# Altium schematic sheet JTAG_Configuration.SchDoc: RFSoC AMC
size 420 x 297 mm; CompanyName: WUT; DrawnBy: T. Przywozki; Organization: WUT ISE; Address1: Warsaw University of Technology; Address2: Nowowiejska 15/19 00-665 Warsaw; Address3: Tomasz.Przywozki@pw.edu.pl; DocumentNumber: 38; Revision: 1; SheetNumber: 38; SheetTotal: 45; Project: RFSoC AMC; ModifiedBy: T. Przywozki; CreateDate: -; CheckedDate: -; DivGrp: ISE; Designer: T. Przywozki; ModifiedDate: -; ProjectName: ADC/DAC MEZZANINE
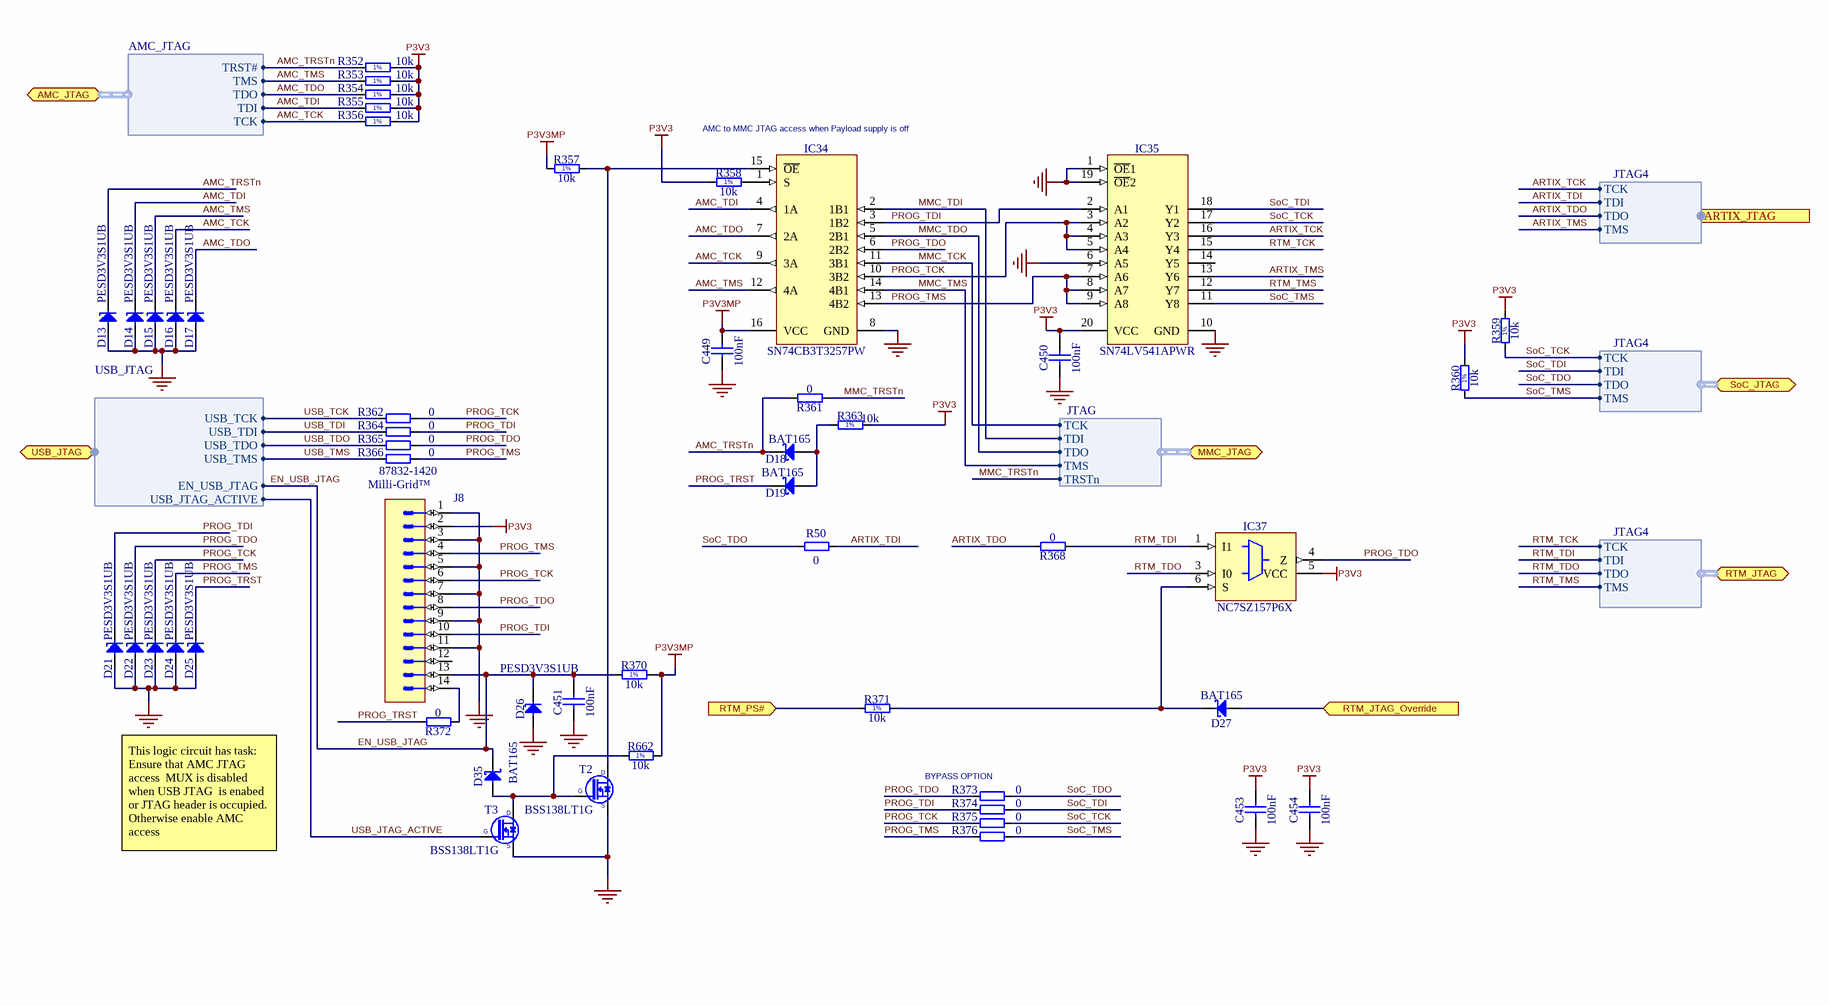
[diagram p0: JTAG_Configuration.SchDoc]

## Parts
C449  100nF  [CAPC0603X33N]
C450  100nF  [CAPC0603X33N]
C451  100nF  [CAPC0603X33N]
C453  100nF  [CAPC0603X33N]
C454  100nF  [CAPC0603X33N]
D13  PESD3V3S1UB  [SODFL1608X65N]
D14  PESD3V3S1UB  [SODFL1608X65N]
D15  PESD3V3S1UB  [SODFL1608X65N]
D16  PESD3V3S1UB  [SODFL1608X65N]
D17  PESD3V3S1UB  [SODFL1608X65N]
D18  BAT165  [SOD2512X110N]
D19  BAT165  [SOD2512X110N]
D21  PESD3V3S1UB  [SODFL1608X65N]
D22  PESD3V3S1UB  [SODFL1608X65N]
D23  PESD3V3S1UB  [SODFL1608X65N]
D24  PESD3V3S1UB  [SODFL1608X65N]
D25  PESD3V3S1UB  [SODFL1608X65N]
D26  PESD3V3S1UB  [SODFL1608X65N]
D27  BAT165  [SOD2512X110N]
D35  BAT165  [SOD2512X110N]
IC34  SN74CB3T3257PW  [SOP65P640X120-16N]
IC35  SN74LV541APWR  [SOP65P640X120-20N]
IC37  NC7SZ157P6X  [SOT65P210X110-6N]
J8  Milli-Grid™  Manufacturer Part Number: 87832-1420  [MOLEX_87832-1420]
R50  0  [RESC1005X40N]
R352  10k  [RESC1005X40N]
R353  10k  [RESC1005X40N]
R354  10k  [RESC1005X40N]
R355  10k  [RESC1005X40N]
R356  10k  [RESC1005X40N]
R357  10k  [RESC1005X40N]
R358  10k  [RESC1005X40N]
R359  10k  [RESC1005X40N]
R360  10k  [RESC1005X40N]
R361  0  [RESC1005X40N]
R362  0  [RESC1005X40N]
R363  10k  [RESC1005X40N]
R364  0  [RESC1005X40N]
R365  0  [RESC1005X40N]
R366  0  [RESC1005X40N]
R368  0  [RESC1005X40N]
R370  10k  [RESC1005X40N]
R371  10k  [RESC1005X40N]
R372  0  [RESC1005X40N]
R373  0  [RESC1005X40N]
R374  0  [RESC1005X40N]
R375  0  [RESC1005X40N]
R376  0  [RESC1005X40N]
R662  10k  [RESC1005X40N]
T2  BSS138LT1G  [SOT95P240X110-3N]
T3  BSS138LT1G  [SOT95P240X110-3N]

## Ports
AMC_JTAG (bidir, harness AMC_JTAG), ARTIX_JTAG (harness JTAG4), MMC_JTAG (bidir, harness JTAG), RTM_JTAG (bidir, harness JTAG4), RTM_JTAG_Override (in), RTM_PS# (in), SoC_JTAG (bidir, harness JTAG4), USB_JTAG (bidir, harness USB_JTAG)

## Harnesses
JTAG4: TCK, TDI, TDO, TMS
JTAG: TCK, TDI, TDO, TMS, TRSTn
USB_JTAG: USB_TDI, USB_TCK, USB_TMS, USB_TDO, USB_JTAG_ACTIVE, EN_USB_JTAG
AMC_JTAG: TCK, TDI, TDO, TMS, TRST#

## Nets
GND: C449.1 C450.1 C451.1 C453.1 C454.1 D13.2(A) D14.2(A) D15.2(A) D16.2(A) D17.2(A) D21.2(A) D22.2(A) D23.2(A) D24.2(A) D25.2(A) D26.2(A) IC34.8(GND) IC35.1(~{OE}1) IC35.6(A5) IC35.10(GND) IC35.19(~{OE}2) IC37.2(GND) J8.1 J8.3 J8.5 J8.7 J8.9 J8.11 T2.2(S) T3.2(S)
P3V3: C450.2 C453.2 C454.2 IC35.20(VCC) IC37.5(VCC) J8.2 R352.1 R353.1 R354.1 R355.1 R356.1 R358.2 R359.2 R360.2 R363.1
P3V3MP: C449.2 IC34.16(VCC) R357.2 R370.2 R662.2
AMC_TCK: D16.1(C) IC34.9(3A) R356.2 ; port AMC_JTAG.TCK
AMC_TDI: D14.1(C) IC34.4(1A) R355.2 ; port AMC_JTAG.TDI
AMC_TDO: D17.1(C) IC34.7(2A) R354.2 ; port AMC_JTAG.TDO
AMC_TMS: D15.1(C) IC34.12(4A) R353.2 ; port AMC_JTAG.TMS
AMC_TRSTn: D13.1(C) D18.1(C) R352.2 R361.2 ; port AMC_JTAG.TRST#
ARTIX_TCK: IC35.16(Y3) ; port ARTIX_JTAG.TCK
ARTIX_TDI: R50.1 ; port ARTIX_JTAG.TDI
ARTIX_TDO: R368.2 ; port ARTIX_JTAG.TDO
ARTIX_TMS: IC35.13(Y6) ; port ARTIX_JTAG.TMS
EN_USB_JTAG: C451.2 D26.1(C) D35.1(C) J8.13 R370.1 ; port USB_JTAG.EN_USB_JTAG
MMC_TCK: IC34.11(3B1) ; port MMC_JTAG.TCK
MMC_TDI: IC34.2(1B1) ; port MMC_JTAG.TDI
MMC_TDO: IC34.5(2B1) ; port MMC_JTAG.TDO
MMC_TMS: IC34.14(4B1) ; port MMC_JTAG.TMS
MMC_TRSTn: R361.1 ; port MMC_JTAG.TRSTn
PROG_TCK: D23.1(C) IC34.10(3B2) IC35.3(A2) IC35.4(A3) IC35.5(A4) J8.6 R362.1 R375.2
PROG_TDI: D21.1(C) IC34.3(1B2) IC35.2(A1) J8.10 R364.1 R374.2
PROG_TDO: D22.1(C) IC34.6(2B2) IC37.4(Z) J8.8 R365.1 R373.2
PROG_TMS: D24.1(C) IC34.13(4B2) IC35.7(A6) IC35.8(A7) IC35.9(A8) J8.4 R366.1 R376.2
PROG_TRST: D19.1(C) D25.1(C) R372.2
RTM_JTAG_Override: D27.2(A) ; port RTM_JTAG_Override
RTM_PS#: R371.2 ; port RTM_PS#
RTM_TCK: IC35.15(Y4) ; port RTM_JTAG.TCK
RTM_TDI: IC37.1(I1) R368.1 ; port RTM_JTAG.TDI
RTM_TDO: IC37.3(I0) ; port RTM_JTAG.TDO
RTM_TMS: IC35.12(Y7) ; port RTM_JTAG.TMS
SoC_TCK: IC35.17(Y2) R359.1 R375.1 ; port SoC_JTAG.TCK
SoC_TDI: IC35.18(Y1) R374.1 ; port SoC_JTAG.TDI
SoC_TDO: R50.2 R373.1 ; port SoC_JTAG.TDO
SoC_TMS: IC35.11(Y8) R360.1 R376.1 ; port SoC_JTAG.TMS
USB_JTAG_ACTIVE: T3.1(G) ; port USB_JTAG.USB_JTAG_ACTIVE
USB_TCK: R362.2 ; port USB_JTAG.USB_TCK
USB_TDI: R364.2 ; port USB_JTAG.USB_TDI
USB_TDO: R365.2 ; port USB_JTAG.USB_TDO
USB_TMS: R366.2 ; port USB_JTAG.USB_TMS
NetD18_2: D18.2(A) D19.2(A) R363.2
NetD27_1: D27.1(C) IC37.6(S) R371.1
NetD35_2: D35.2(A) R662.1 T2.1(G) T3.3(D)
NetIC34_1: IC34.1(S) R358.1
NetIC34_15: IC34.15(~{OE}) R357.1 T2.3(D)
NetJ8_14: J8.14 R372.1

Not connected (* = marked no-connect by the designer): IC35 14(Y5); J8 12

## Notes on the sheet
- AMC to MMC JTAG access when Payload supply is off
- (near R373) BYPASS OPTION
- This logic circuit has task: Ensure that AMC JTAG access  MUX is disabled when USB JTAG  is enabed or JTAG header is occupied. Otherwise enable AMC access
- Project/Equipment
- Document
- Designer
- Drawn by
- Check.by
- Copyright WUT ISE 2021
  This documentation describes Open Hardware and is licensed under CERN OHL v.1.1. You may redistribute and modify this documentaction under the terms of the CERN OHL v1.1.
  (http://ohwr.org/CERNOHL). This documentation is dristributed WITHOUT ANY EXPRESS OR IMPLIED WARRANTY, INCLUDING OF MERCHANTABLITY, SATISFACTORY QUALITY AND FITNESS FOR A PARTICULAR PURPOSE. Please see the CERN OHL v.1.1 for applicable conditions
- File
- Last Mod.
- Print Date
- Sheet
- Size
- A3
- of
- Rev
- Contact:
- (in symbol R0402_10K_1%_0.0625W_100PPM) 1%

## Library data of the parts
C449-C451 C453 C454 = CC0201_100NF_6.3V_10%_X5R: Non-polarised capacitor; Manufacturer: GENERIC; Part Description: SMD Multilayer Chip Ceramic Capacitor; Manufacturer1 Part Number: 02016D104KAT2A; Tolerance: ±10%; Voltage: 6.3V; TC: X5R; Manufacturer Part Number: CC0201_100NF_6.3V_10%_X5R; Part Number: CC0201_100NF_6.3V_10%_X5R; Value: 100nF; Component Kind: Standard; Component Type: Standard; Pin Count: 2; Status: Not Recommended; Case: 0201; Mounted: Yes; Socket: No; SMD: Yes; Sense: No; Manufacturer1 Example: AVX; Manufacturer1 ComponentHeight: 0.33mm; HelpURL: \\cern.ch\dfs\Applications\Altium\Datasheets\CC0201_X5R_AVX.pdf; Author: CERN DEM JLC; CreateDate: 03.12.2007; LatestRevisionDate: 03.12.2007
D13-D17 D21-D26 = PESD3V3S1UB: ESD protection diode; Manufacturer: NXP SEMICONDUCTORS; Part Description: ESD protection diode (23kV); Voltage: 3V3; Power: 330W; PressFit: No; Bonding: No; Manufacturer Part Number: PESD3V3S1UB; PackageDescription: Ultra Small Outline Diode Flat Lead (SOD-523), Body; 1.2mm L X 0.8mm W X 0.65mm H, IPC Medium Density; Part Number: PESD3V3S1UB; Component Kind: Standard; Component Type: Standard; Device: PESD3V3S1UB; Pin Count: 2; Case: SOD523; Mounted: Yes; Socket: No; SMD: Yes; Sense: No; ComponentHeight: 0.65mm; HelpURL: \\cern.ch\dfs\Applications\Altium\Datasheets\PESD3V3S1UB.pdf; Author: CERN DEM JLC; CreateDate: 29.11.2012; LatestRevisionDate: 29.11.2012
D18 D19 D27 D35 = BAT165: Schottky Diode; Manufacturer: INFINEON; Part Description: Medium Power AF Schottky Diode; Voltage: 40V; Power: 750mA; PressFit: No; Bonding: No; Manufacturer Part Number: BAT165; PackageDescription: Small Outline Diode (SOD-323), 1.70mm W X 1.25mm L X 1.10mm H body,  IPC Medium Density; Part Number: BAT165; Component Kind: Standard; Component Type: Standard; Device: BAT165; Pin Count: 2; Case: SOD323; Mounted: Yes; Socket: No; SMD: Yes; Sense: No; ComponentHeight: 1.1mm; HelpURL: \\cern.ch\dfs\Applications\Altium\Datasheets\BAT165.pdf; Author: CERN DEM JLC; CreateDate: 12.11.2014; LatestRevisionDate: 12.11.2014
IC34 = SN74CB3T3257PW: 4-BIT 1-OF-2 FET Multiplexer/Demultiplexer 2.5V/3.3V Low-Voltage Bus Switch 5V Tolerant Shifter; Manufacturer: TEXAS INSTRUMENTS; PressFit: No; Bonding: No; Manufacturer Part Number: SN74CB3T3257PW; PackageDescription: SOP, 0.65mm pitch; 16 pin, 4.40mm W X 5.00mm L X 1.20mm H body IPC Medium Density; Part Description: 4-Bit 1-of-2 FET Multiplexer/Demultiplexer 2.5V/3.3V Low-Voltage Bus Switch 5V Tolerant Shifter; Part Number: SN74CB3T3257PW; Component Kind: Standard; Component Type: Standard; Device: SN74CB3T3257PW; Pin Count: 16; Case: TSSOP16; Mounted: Yes; Socket: No; SMD: Yes; Sense: No; ComponentHeight: 1.2mm; Author: CERN DEM JLC; HelpURL: \\cern.ch\dfs\Applications\Altium\Datasheets\SN74CB3T3257PW.pdf; CreateDate: 30.01.2012; LatestRevisionDate: 30.01.2012
IC35 = SN74LV541APWR: Octal Buffer/Line Driver with 3-State Outputs; Manufacturer: TEXAS INSTRUMENTS; Part Description: Octal Bus Transceiver/Driver with 3-State Outputs; PressFit: No; Bonding: No; Manufacturer Part Number: SN74LV541APWR; PackageDescription: SOP, 20-Leads, Body 6.5x4.4mm, Pitch 0.65mm, IPC Medium Density; Part Number: SN74LV541APWR; Component Kind: Standard; Component Type: Standard; Device: SN74LV541APWR; Pin Count: 20; Case: TSSOP20; Mounted: Yes; Socket: No; SMD: Yes; Sense: No; ComponentHeight: 1.2mm; Author: CERN DEM JLC; HelpURL: \\cern.ch\dfs\Applications\Altium\Datasheets\SN74LV541APWR.pdf; CreateDate: 07.07.2014; LatestRevisionDate: 07.07.2014
IC37 = NC7SZ157P6X: TinyLogic® UHS 2-Input Non-Inverting Multiplexer; Manufacturer: FAIRCHILD SEMICONDUCTOR; PressFit: No; Bonding: No; Manufacturer Part Number: NC7SZ157P6X; PackageDescription: SOT363, 0.65mm pitch; 6 pin, 1.40mm W X 2.15mm L, IPC Medium Density; Part Description: TinyLogic® UHS 2-Input Non-Inverting Multiplexer; Part Number: NC7SZ157P6X; Component Kind: Standard; Component Type: Standard; Device: NC7SZ157P6X; Pin Count: 6; Case: SOT363; Mounted: Yes; Socket: No; SMD: Yes; Sense: No; ComponentHeight: 1.1mm; Author: CERN DEM JLC; HelpURL: \\cern.ch\dfs\Applications\Altium\Datasheets\NC7SZ157P6X.pdf; CreateDate: 22.03.2012; LatestRevisionDate: 22.03.2012
J8 = MOLEX_87832-1420: Connector 14 Male; Manufacturer: MOLEX; Part Description: 2.00mm (.079") Pitch Milli-Grid™ Header, Surface Mount, Vertical, Shrouded, 14 Circuits,with Locking Windows and Centre Polarization Slot, PCB Locator; PressFit: No; Part Number: MOLEX_87832-1420; Component Kind: Standard; Component Type: Standard; Pin Count: 14; Family: Milli-Grid™; Mounted: Yes; Socket: No; SMD: Yes; Sense: No; Status: None; ComponentHeight: 7.6mm; HelpURL: \\cern.ch\dfs\Applications\Altium\Datasheets\MOLEX_87832-1420.pdf; Author: CERN DEM JLC; CreateDate: 09.09.2008; LatestRevisionDate: 09.09.2008
R50 R361 R362 R364-R366 R368 R372-R376 = R0402_0R_JUMPER: Resistor; Manufacturer: GENERIC; Part Description: 1A (0.05R Max DC Resistance) Zero Ohm Jumper; Manufacturer1 Part Number: 232270591001L; PressFit: No; Manufacturer Part Number: R0402_0R_JUMPER; Part Number: R0402_0R_JUMPER; Value: 0; Component Kind: Standard; Component Type: Standard; Pin Count: 2; Status: Not Recommended; Case: 0402; Mounted: Yes; Sense: No; Socket: No; SMD: Yes; Manufacturer1 Example: YAGEO PHYCOMP; Manufacturer1 ComponentHeight: 0.4mm; HelpURL: \\cern.ch\dfs\Applications\Altium\Datasheets\R0402_Phycomp_RC0402.pdf; Author: CERN DEM JLC; CreateDate: 03.12.2007; LatestRevisionDate: 17.10.2012
R352-R360 R363 R370 R371 R662 = R0402_10K_1%_0.0625W_100PPM: Resistor - 1%; Manufacturer: GENERIC; Part Description: General Purpose Thick Film Chip Resistor; Manufacturer1 Part Number: 232270671003L; TC: ±100ppm/°C; PressFit: No; Manufacturer Part Number: R0402_10K_1%_0.0625W_100PPM; Part Number: R0402_10K_1%_0.0625W_100PPM; Tolerance: ±1%; Value: 10k; Component Kind: Standard; Component Type: Standard; Pin Count: 2; Status: Not Recommended; Power: 0.0625W; Case: 0402; Mounted: Yes; Sense: No; Socket: No; SMD: Yes; Manufacturer1 Example: YAGEO PHYCOMP; Manufacturer1 ComponentHeight: 0.4mm; HelpURL: \\cern.ch\dfs\Applications\Altium\Datasheets\R0402_Phycomp_RC0402.pdf; Author: CERN DEM JLC; CreateDate: 03.12.2007; LatestRevisionDate: 17.10.2012
T2 T3 = BSS138LT1G: N-CHANNEL MOSFET WITH DIODE; Manufacturer: ON SEMICONDUCTOR; Part Description: 50V 200mA N-Channel Enhancement Mode Field-Effect Transistor; PressFit: No; Bonding: No; Manufacturer Part Number: BSS138LT1G; PackageDescription: SOT23 3-Leads, Pitch 0.95mm - Body 1.4x3mm, IPC Medium Density; Part Number: BSS138LT1G; Component Kind: Standard; Component Type: Standard; Device: BSS138LT1G; Pin Count: 3; Case: SOT23-3; Mounted: Yes; Socket: No; SMD: Yes; Sense: No; ComponentHeight: 1.11mm; HelpURL: \\cern.ch\dfs\Applications\Altium\Datasheets\BSS138LT1G.pdf; Author: CERN DEM JLC; CreateDate: 23.03.2009; LatestRevisionDate: 23.03.2009